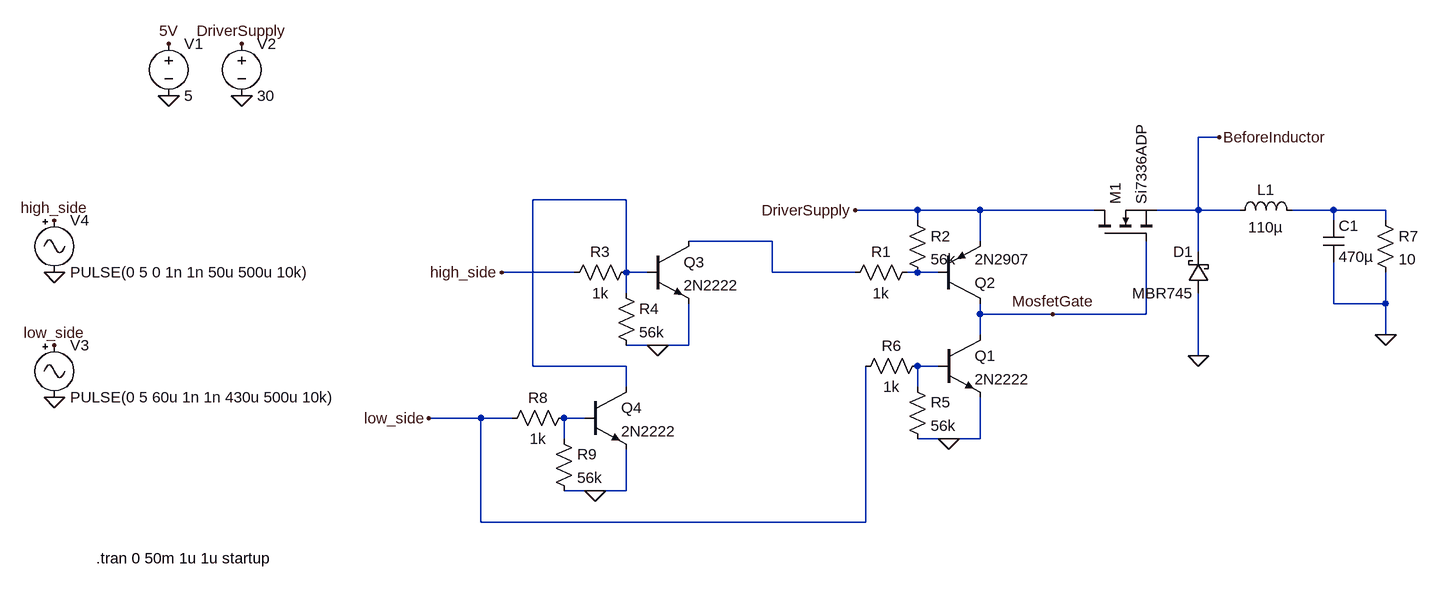
[diagram p0: schematic MosfetDriverAntiLatchup_N.asc]
MosfetDriverAntiLatchup_N.asc, the LTspice schematic file:
Version 4
SHEET 1 1108 680
WIRE 784 -288 752 -288
WIRE -128 -192 -272 -192
WIRE 320 -176 224 -176
WIRE 416 -176 320 -176
WIRE 592 -176 416 -176
WIRE 752 -176 752 -288
WIRE 752 -176 688 -176
WIRE 816 -176 752 -176
WIRE 960 -176 896 -176
WIRE 1040 -176 960 -176
WIRE 320 -160 320 -176
WIRE 960 -160 960 -176
WIRE 1040 -160 1040 -176
WIRE 96 -128 -32 -128
WIRE 416 -128 416 -176
WIRE 752 -112 752 -176
WIRE -208 -80 -320 -80
WIRE -128 -80 -128 -192
WIRE -96 -80 -128 -80
WIRE 96 -80 96 -128
WIRE 224 -80 96 -80
WIRE 320 -80 304 -80
WIRE 352 -80 320 -80
WIRE -128 -48 -128 -80
WIRE 960 -32 960 -96
WIRE 1040 -32 1040 -80
WIRE 1040 -32 960 -32
WIRE 416 -16 416 -32
WIRE 528 -16 416 -16
WIRE 672 -16 672 -128
WIRE 672 -16 528 -16
WIRE 416 16 416 -16
WIRE 1040 16 1040 -32
WIRE -80 32 -128 32
WIRE -32 32 -32 -32
WIRE -32 32 -80 32
WIRE 752 48 752 -48
WIRE -272 64 -272 -192
WIRE -128 64 -272 64
WIRE 352 64 320 64
WIRE -128 96 -128 64
WIRE 320 96 320 64
WIRE -352 144 -432 144
WIRE -304 144 -352 144
WIRE -192 144 -224 144
WIRE -224 176 -224 144
WIRE 368 176 320 176
WIRE 416 176 416 112
WIRE 416 176 368 176
WIRE -176 256 -224 256
WIRE -128 256 -128 192
WIRE -128 256 -176 256
WIRE -352 304 -352 144
WIRE 240 304 240 64
WIRE 240 304 -352 304
FLAG -832 -352 0
FLAG -832 -432 5V
FLAG -720 -352 0
FLAG -720 -432 DriverSupply
FLAG 368 176 0
FLAG -1008 112 0
FLAG 224 -176 DriverSupply
FLAG -1008 -80 0
FLAG -1008 -160 high_side
FLAG -1008 32 low_side
FLAG -320 -80 high_side
FLAG 528 -16 MosfetGate
FLAG 752 48 0
FLAG 1040 16 0
FLAG -80 32 0
FLAG -432 144 low_side
FLAG -176 256 0
FLAG 784 -288 BeforeInductor
SYMBOL npn 352 16 R0
SYMATTR InstName Q1
SYMATTR Value 2N2222
SYMBOL pnp 352 -32 M180
SYMATTR InstName Q2
SYMATTR Value 2N2907
SYMBOL voltage -832 -448 R0
WINDOW 123 0 0 Left 0
WINDOW 39 0 0 Left 0
SYMATTR InstName V1
SYMATTR Value 5
SYMBOL voltage -720 -448 R0
WINDOW 123 0 0 Left 0
WINDOW 39 0 0 Left 0
SYMATTR InstName V2
SYMATTR Value 30
SYMBOL res 304 80 R0
SYMATTR InstName R5
SYMATTR Value 56k
SYMBOL res 336 48 R90
WINDOW 0 0 56 VBottom 2
WINDOW 3 32 56 VTop 2
SYMATTR InstName R6
SYMATTR Value 1k
SYMBOL Misc\\signal -1008 16 R0
WINDOW 123 0 0 Left 0
WINDOW 39 0 0 Left 0
SYMATTR InstName V3
SYMATTR Value PULSE(0 5 60u 1n 1n 430u 500u 10k)
SYMBOL Misc\\signal -1008 -176 R0
WINDOW 123 0 0 Left 0
WINDOW 39 0 0 Left 0
SYMATTR InstName V4
SYMATTR Value PULSE(0 5 0 1n 1n 50u 500u 10k)
SYMBOL ind 800 -160 R270
WINDOW 0 32 56 VTop 2
WINDOW 3 5 56 VBottom 2
SYMATTR InstName L1
SYMATTR Value 110µ
SYMBOL schottky 768 -48 R180
WINDOW 0 24 64 Left 2
WINDOW 3 24 0 Left 2
SYMATTR InstName D1
SYMATTR Value MBR745
SYMBOL res 1024 -176 R0
SYMATTR InstName R7
SYMATTR Value 10
SYMBOL res 320 -96 R90
WINDOW 0 0 56 VBottom 2
WINDOW 3 32 56 VTop 2
SYMATTR InstName R1
SYMATTR Value 1k
SYMBOL res 304 -176 R0
SYMATTR InstName R2
SYMATTR Value 56k
SYMBOL npn -96 -128 R0
SYMATTR InstName Q3
SYMATTR Value 2N2222
SYMBOL res -112 -96 R90
WINDOW 0 0 56 VBottom 2
WINDOW 3 32 56 VTop 2
SYMATTR InstName R3
SYMATTR Value 1k
SYMBOL res -144 -64 R0
SYMATTR InstName R4
SYMATTR Value 56k
SYMBOL npn -192 96 R0
SYMATTR InstName Q4
SYMATTR Value 2N2222
SYMBOL res -208 128 R90
WINDOW 0 0 56 VBottom 2
WINDOW 3 32 56 VTop 2
SYMATTR InstName R8
SYMATTR Value 1k
SYMBOL res -240 160 R0
SYMATTR InstName R9
SYMATTR Value 56k
SYMBOL cap 944 -160 R0
SYMATTR InstName C1
SYMATTR Value 470µ
SYMBOL nmos 592 -128 R270
SYMATTR InstName M1
SYMATTR Value Si7336ADP
TEXT -944 360 Left 2 !.tran 0 50m 1u 1u startup

The netlist it stands for:
* MosfetDriverAntiLatchup_N.asc
Q1 MosfetGate N005 0 0 2N2222
Q2 MosfetGate N004 DriverSupply 0 2N2907
V1 5V 0 5
V2 DriverSupply 0 30
R5 N005 0 56k
R6 N005 low_side 1k
V3 low_side 0 PULSE(0 5 60u 1n 1n 430u 500u 10k)
V4 high_side 0 PULSE(0 5 0 1n 1n 50u 500u 10k)
L1 BeforeInductor N002 110µ
D1 0 BeforeInductor MBR745
R7 N002 0 10
R1 N004 N003 1k
R2 DriverSupply N004 56k
Q3 N003 N001 0 0 2N2222
R3 N001 high_side 1k
R4 N001 0 56k
Q4 N001 N006 0 0 2N2222
R8 N006 low_side 1k
R9 N006 0 56k
C1 N002 0 470µ
M1 DriverSupply MosfetGate BeforeInductor BeforeInductor Si7336ADP
.model D D
.lib standard.dio
.model NPN NPN
.model PNP PNP
.lib standard.bjt
.model NMOS NMOS
.model PMOS PMOS
.lib standard.mos
.tran 0 50m 1u 1u startup
.backanno
.end